# EAGLE board SBC_65C02_IRQ_BigBoard_v10-2-1 (EAGLE 9.6.2), part 1 of 2
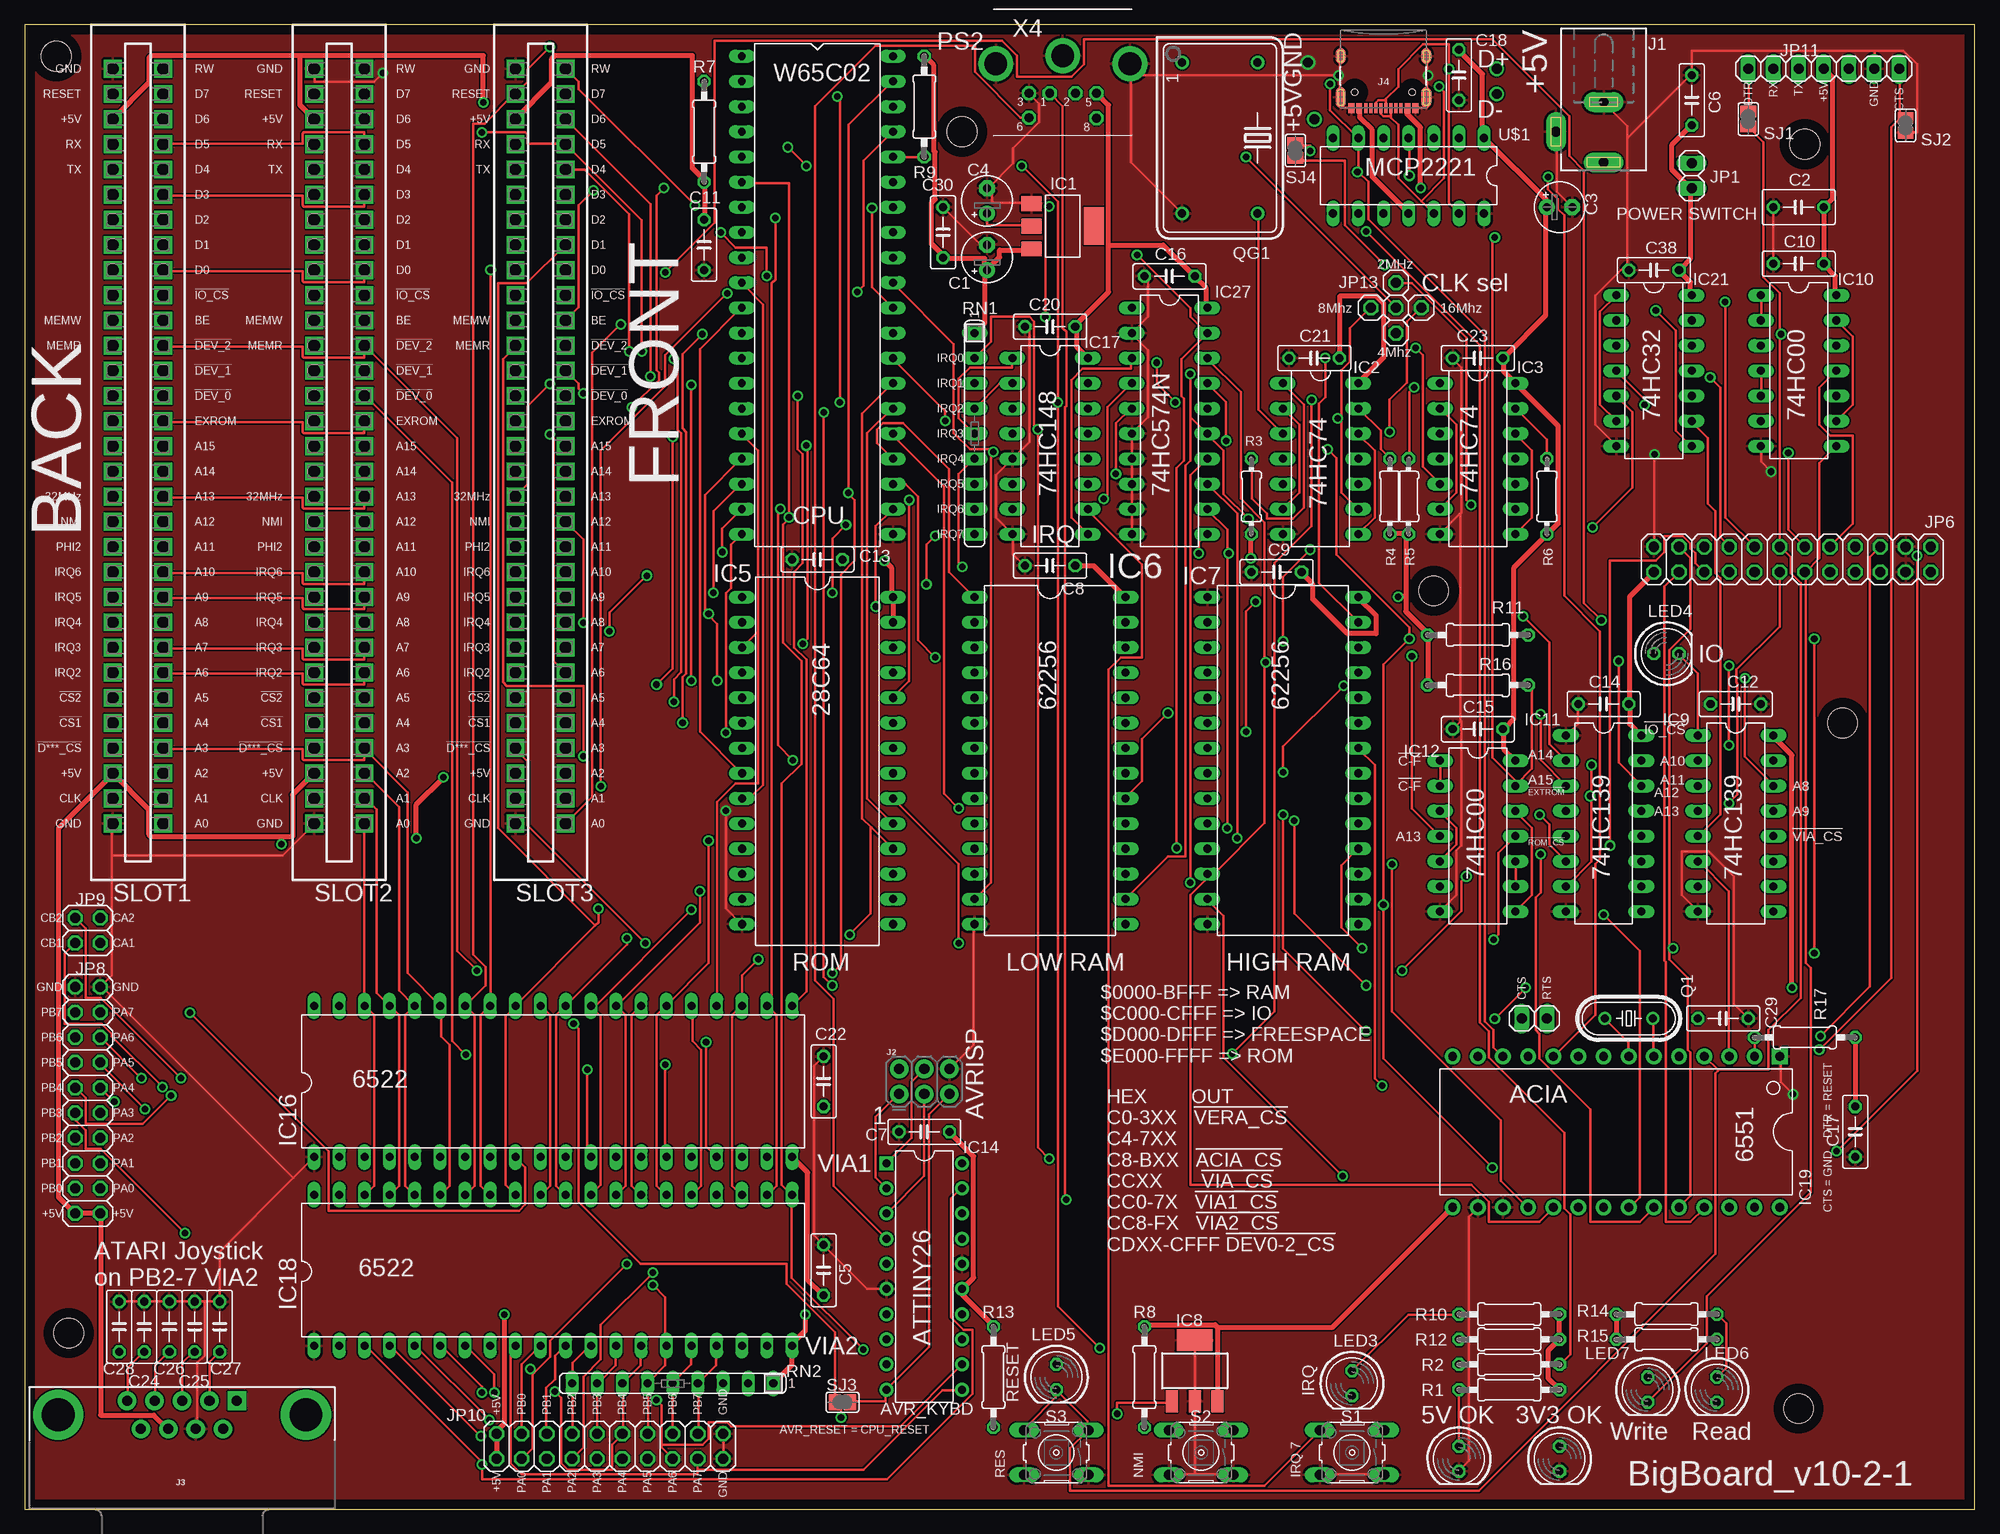
[diagram p8: board, top side]
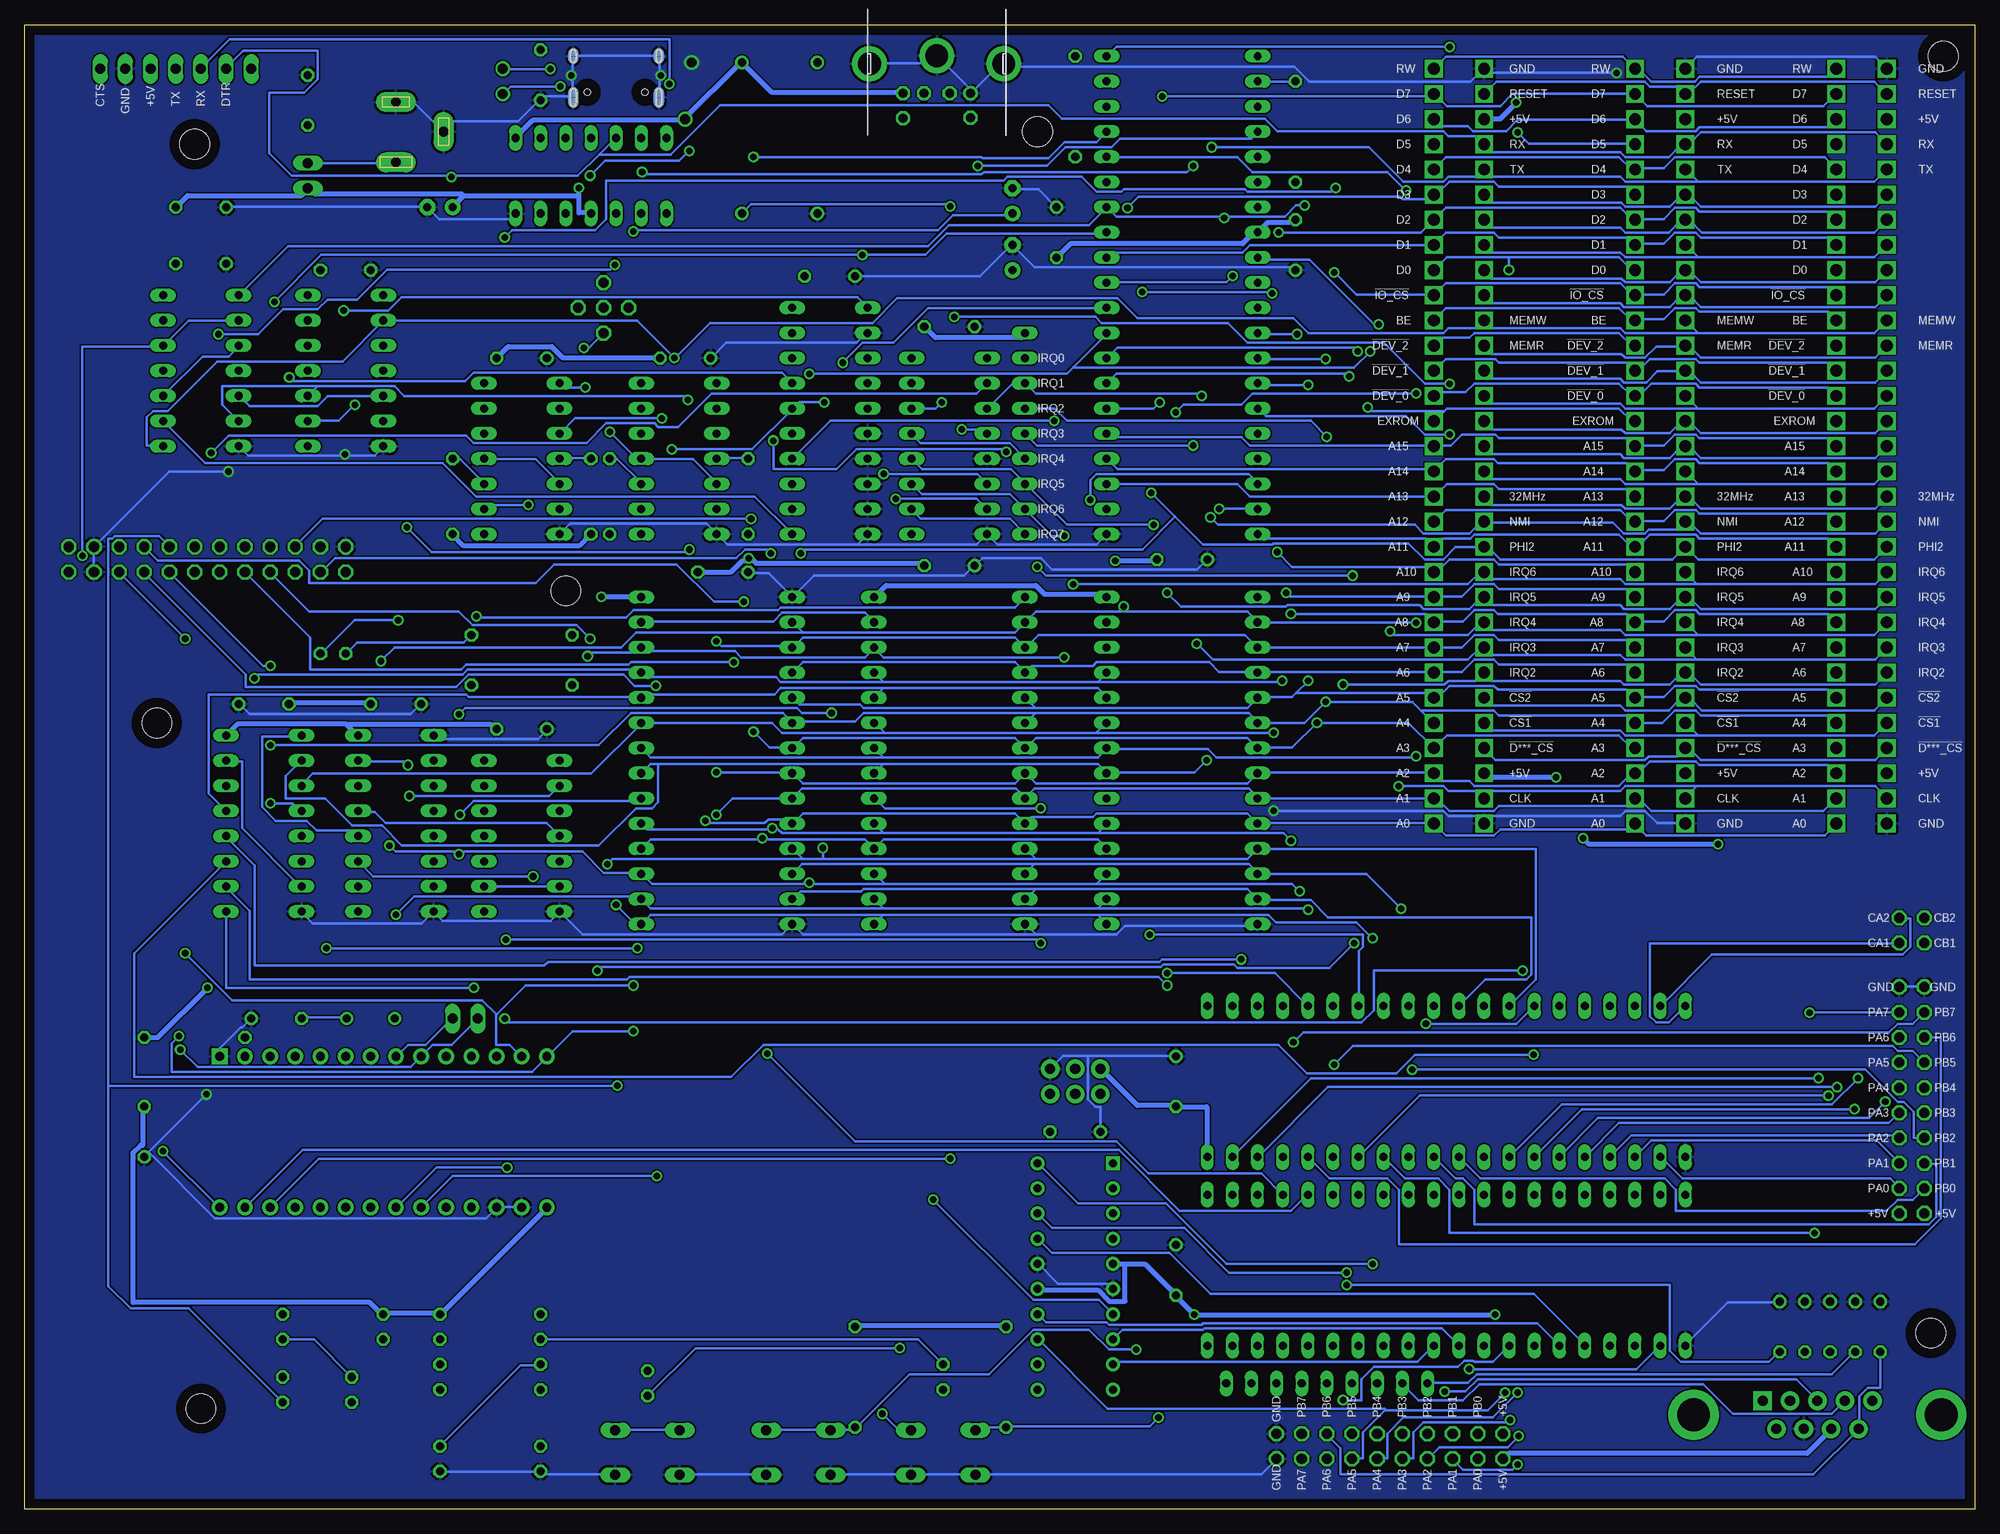
[diagram p9: board, bottom side, seen from below]

Size 196.85 x 149.86 mm. Coordinates in mm from the lower left corner, seen from the top.
Outline: 0,149.86 0,0 196.85,0 196.85,149.86 0,149.86
Copper layers (1*16): Top 0.035mm / dielectric 1.5mm / Bottom 0.035mm
Design rules "default *": minimum track width 6mil, minimum drill 0.35mm, track to track 6mil, track to pad 6mil, pad to pad 6mil, via to via 6mil, smd to smd 6mil, copper to edge 40mil, drill to drill 6mil, minimum pad ring 10mil, minimum via ring 8mil, stop-mask expansion 4mil, vias tented up to drill 0mil, thermal gap 10mil
Net classes: 0 default: width 0.254 mm, drill 0.66 mm, clearance 0.152 mm; 1 power: width 0.508 mm, drill 0.66 mm, clearance 0.178 mm to class 0, clearance 0.178 mm
Holes 3 mm at 3.17,146.69 183.51,79.38 179.7,137.79 179.07,10.16 142.24,92.71 4.45,17.78 94.62,139.06
vRestrict: area 160.7,0.6 to 192.4,7

## Footprints (pad centres in the part's own frame; a part is rotated, then mirrored left to right if it is on the bottom)
E2,5-5 = drill 0.813 pad 1.6: + -1.27,0 | drill 0.813 pad 1.6 octagon: - 1.27,0
C050-035X075 = drill 0.813 octagon: 1 -2.54,0; 2 2.54,0
C050-025X075 = drill 0.813 octagon: 1 -2.54,0; 2 2.54,0
SOT223 = smd 1.499 x 2.007: 1 -2.261,-3.15; 2 0.025,-3.15; 3 2.311,-3.15 | smd 3.81 x 2.007: 4 0,3.15
DIL14 = drill 0.813 long: 1 -7.62,-3.81; 2 -5.08,-3.81; 3 -2.54,-3.81; 4 0,-3.81; 5 2.54,-3.81; 6 5.08,-3.81; 7 7.62,-3.81; 8 7.62,3.81; 9 5.08,3.81; 10 2.54,3.81; 11 0,3.81; 12 -2.54,3.81; 13 -5.08,3.81; 14 -7.62,3.81
DIL40 = drill 0.8 long: 1 -7.62,20.32; 2 -7.62,17.78; 3 -7.62,15.24; 4 -7.62,12.7; 5 -7.62,10.16; 6 -7.62,7.62; 7 -7.62,5.08; 8 -7.62,2.54; 9 -7.62,0; 10 -7.62,-2.54; 11 -7.62,-5.08; 12 -7.62,-7.62; 13 -7.62,-10.16; 14 -7.62,-12.7; 15 -7.62,-15.24; 16 -7.62,-17.78; 17 -7.62,-20.32; 18 -7.62,-22.86; 19 -7.62,-25.4; 20 -7.62,-27.94; 21 7.62,-27.94; 22 7.62,-25.4; 23 7.62,-22.86; 24 7.62,-20.32; 25 7.62,-17.78; 26 7.62,-15.24; 27 7.62,-12.7; 28 7.62,-10.16; 29 7.62,-7.62; 30 7.62,-5.08; 31 7.62,-2.54; 32 7.62,0; 33 7.62,2.54; 34 7.62,5.08; 35 7.62,7.62; 36 7.62,10.16; 37 7.62,12.7; 38 7.62,15.24; 39 7.62,17.78; 40 7.62,20.32
DIL28-6 = drill 0.813 long: 1 -16.51,-7.62; 2 -13.97,-7.62; 3 -11.43,-7.62; 4 -8.89,-7.62; 5 -6.35,-7.62; 6 -3.81,-7.62; 7 -1.27,-7.62; 8 1.27,-7.62; 9 3.81,-7.62; 10 6.35,-7.62; 11 8.89,-7.62; 12 11.43,-7.62; 13 13.97,-7.62; 14 16.51,-7.62; 15 16.51,7.62; 16 13.97,7.62; 17 11.43,7.62; 18 8.89,7.62; 19 6.35,7.62; 20 3.81,7.62; 21 1.27,7.62; 22 -1.27,7.62; 23 -3.81,7.62; 24 -6.35,7.62; 25 -8.89,7.62; 26 -11.43,7.62; 27 -13.97,7.62; 28 -16.51,7.62
SOT223' = smd 1.219 x 2.235: 1 -2.311,-3.099; 2 0,-3.099; 3 2.311,-3.099 | smd 3.6 x 2.2: 4 0,3.099
DIL16 = drill 0.813 long: 1 -8.89,-3.81; 2 -6.35,-3.81; 3 -3.81,-3.81; 4 -1.27,-3.81; 5 1.27,-3.81; 6 3.81,-3.81; 7 6.35,-3.81; 8 8.89,-3.81; 9 8.89,3.81; 10 6.35,3.81; 11 3.81,3.81; 12 1.27,3.81; 13 -1.27,3.81; 14 -3.81,3.81; 15 -6.35,3.81; 16 -8.89,3.81
DIL20 = drill 0.8 pad 1.4 square: 1 -11.43,-3.81 | drill 0.8 pad 1.4: 2 -8.89,-3.81; 3 -6.35,-3.81; 4 -3.81,-3.81; 5 -1.27,-3.81; 6 1.27,-3.81; 7 3.81,-3.81; 8 6.35,-3.81; 9 8.89,-3.81; 10 11.43,-3.81; 11 11.43,3.81; 12 8.89,3.81; 13 6.35,3.81; 14 3.81,3.81; 15 1.27,3.81; 16 -1.27,3.81; 17 -3.81,3.81; 18 -6.35,3.81; 19 -8.89,3.81; 20 -11.43,3.81
DIL40' = drill 0.813 long: 1 -24.13,-7.62; 2 -21.59,-7.62; 3 -19.05,-7.62; 4 -16.51,-7.62; 5 -13.97,-7.62; 6 -11.43,-7.62; 7 -8.89,-7.62; 8 -6.35,-7.62; 9 -3.81,-7.62; 10 -1.27,-7.62; 11 1.27,-7.62; 12 3.81,-7.62; 13 6.35,-7.62; 14 8.89,-7.62; 15 11.43,-7.62; 16 13.97,-7.62; 17 16.51,-7.62; 18 19.05,-7.62; 19 21.59,-7.62; 20 24.13,-7.62; 21 24.13,7.62; 22 21.59,7.62; 23 19.05,7.62; 24 16.51,7.62; 25 13.97,7.62; 26 11.43,7.62; 27 8.89,7.62; 28 6.35,7.62; 29 3.81,7.62; 30 1.27,7.62; 31 -1.27,7.62; 32 -3.81,7.62; 33 -6.35,7.62; 34 -8.89,7.62; 35 -11.43,7.62; 36 -13.97,7.62; 37 -16.51,7.62; 38 -19.05,7.62; 39 -21.59,7.62; 40 -24.13,7.62
DIP-28 = drill 0.889 pad 1.6 square: 1 -15.24,-7.62 | drill 0.889 pad 1.6: 2 -12.7,-7.62; 3 -10.16,-7.62; 4 -7.62,-7.62; 5 -5.08,-7.62; 6 -2.54,-7.62; 7 0,-7.62; 8 2.54,-7.62; 9 5.08,-7.62; 10 7.62,-7.62; 11 10.16,-7.62; 12 12.7,-7.62; 13 15.24,-7.62; 14 17.78,-7.62; 15 17.78,7.62; 16 15.24,7.62; 17 12.7,7.62; 18 10.16,7.62; 19 7.62,7.62; 20 5.08,7.62; 21 2.54,7.62; 22 0,7.62; 23 -2.54,7.62; 24 -5.08,7.62; 25 -7.62,7.62; 26 -10.16,7.62; 27 -12.7,7.62; 28 -15.24,7.62
DIL20' = drill 0.813 long: 1 -11.43,-3.81; 2 -8.89,-3.81; 3 -6.35,-3.81; 4 -3.81,-3.81; 5 -1.27,-3.81; 6 1.27,-3.81; 7 3.81,-3.81; 8 6.35,-3.81; 9 8.89,-3.81; 10 11.43,-3.81; 11 11.43,3.81; 12 8.89,3.81; 13 6.35,3.81; 14 3.81,3.81; 15 1.27,3.81; 16 -1.27,3.81; 17 -3.81,3.81; 18 -6.35,3.81; 19 -8.89,3.81; 20 -11.43,3.81
DCJ0202 = drill 1 pad 2 long: 1 0,3.1; 2 4.8,0; 3 0,-3
2X3-NS = drill 1.016 pad 1.88: 1 -2.54,-1.27; 2 -2.54,1.27; 3 0,-1.27; 4 0,1.27; 5 2.54,-1.27; 6 2.54,1.27
DB9_MALE = drill 1.016 pad 1.88: 1 5.54,-1.42; 2 2.77,-1.42; 3 0,-1.42; 4 -2.77,-1.42; 6 4.15,1.42; 7 1.38,1.42; 8 -1.38,1.42; 9 -4.15,1.42 | drill 1.016 pad 1.88 square: 5 -5.54,-1.42 | drill 3.302 pad 5.08: G1 -12.5,0; G2 12.5,0
USB-C-16P = smd 0.3 x 1.016: A5 -1.25,0.154; A6 -0.25,0.154; A7 0.25,0.154; A8 1.25,0.154; B5 1.75,0.154; B6 0.75,0.154; B7 -0.75,0.154; B8 -1.75,0.154 | smd 0.6 x 1.016: GND -3.225,0.154; GND2 3.225,0.154 | smd 1 x 2.1: SHLD1 -4.32,-0.915; SHLD2 4.32,-0.915 | smd 1 x 2.1 bottom: SHLD3 -4.32,-0.915; SHLD4 4.32,-0.915 | smd 1 x 1.6: SHLD5 -4.32,-5.095; SHLD8 4.32,-5.095 | smd 1 x 1.6 bottom: SHLD6 -4.32,-5.095; SHLD7 4.32,-5.095 | smd 0.55 x 1.016: VBUS1 -2.45,0.154; VBUS2 2.45,0.154 | hole 0.65: -2.89,-1.445; 2.89,-1.445
1X02 = drill 1.016 long: 1 -1.27,0; 2 1.27,0
1X01 = drill 1.016 octagon: 1 0,0
2X12 = drill 1.016 octagon: 1 -13.97,-1.27; 2 -13.97,1.27; 3 -11.43,-1.27; 4 -11.43,1.27; 5 -8.89,-1.27; 6 -8.89,1.27; 7 -6.35,-1.27; 8 -6.35,1.27; 9 -3.81,-1.27; 10 -3.81,1.27; 11 -1.27,-1.27; 12 -1.27,1.27; 13 1.27,-1.27; 14 1.27,1.27; 15 3.81,-1.27; 16 3.81,1.27; 17 6.35,-1.27; 18 6.35,1.27; 19 8.89,-1.27; 20 8.89,1.27; 21 11.43,-1.27; 22 11.43,1.27; 23 13.97,-1.27; 24 13.97,1.27
2X10 = drill 1.016 octagon: 1 -11.43,-1.27; 2 -11.43,1.27; 3 -8.89,-1.27; 4 -8.89,1.27; 5 -6.35,-1.27; 6 -6.35,1.27; 7 -3.81,-1.27; 8 -3.81,1.27; 9 -1.27,-1.27; 10 -1.27,1.27; 11 1.27,-1.27; 12 1.27,1.27; 13 3.81,-1.27; 14 3.81,1.27; 15 6.35,-1.27; 16 6.35,1.27; 17 8.89,-1.27; 18 8.89,1.27; 19 11.43,-1.27; 20 11.43,1.27
2X02 = drill 1.016 octagon: 1 -1.27,-1.27; 2 -1.27,1.27; 3 1.27,-1.27; 4 1.27,1.27
1X07 = drill 1.016 long: 1 -7.62,0; 2 -5.08,0; 3 -2.54,0; 4 0,0; 5 2.54,0; 6 5.08,0; 7 7.62,0
LED5MM = drill 0.813 octagon: A -1.27,0; K 1.27,0
HC49/S = drill 0.813: 1 -2.413,0; 2 2.413,0
DIL14S = drill 0.813: 1 -7.62,-3.81; 7 7.62,-3.81; 8 7.62,3.81; 14 -7.62,3.81
0207/10 = drill 0.813 octagon: 1 -5.08,0; 2 5.08,0
0204/7 = drill 0.813 octagon: 1 -3.81,0; 2 3.81,0
SIL9 = drill 0.813 long: 1 -10.16,0; 2 -7.62,0; 3 -5.08,0; 4 -2.54,0; 5 0,0; 6 2.54,0; 7 5.08,0; 8 7.62,0; 9 10.16,0
B3F-10XX = drill 1.016 long: 1 -3.251,2.261; 2 3.251,2.261; 3 -3.251,-2.261; 4 3.251,-2.261
SJ = smd 1.168 x 1.6: 1 -0.762,0; 2 0.762,0
ISA-8 = drill 1.2 pad 1.778 square: A1 40.64,-2.54; A2 38.1,-2.54; A3 35.56,-2.54; A4 33.02,-2.54; A5 30.48,-2.54; A6 27.94,-2.54; A7 25.4,-2.54; A8 22.86,-2.54; A9 20.32,-2.54; A10 17.78,-2.54; A11 15.24,-2.54; A12 12.7,-2.54; A13 10.16,-2.54; A14 7.62,-2.54; A15 5.08,-2.54; A16 2.54,-2.54; A17 0,-2.54; A18 -2.54,-2.54; A19 -5.08,-2.54; A20 -7.62,-2.54; A21 -10.16,-2.54; A22 -12.7,-2.54; A23 -15.24,-2.54; A24 -17.78,-2.54; A25 -20.32,-2.54; A26 -22.86,-2.54; A27 -25.4,-2.54; A28 -27.94,-2.54; A29 -30.48,-2.54; A30 -33.02,-2.54; A31 -35.56,-2.54; B1 40.64,2.54; B2 38.1,2.54; B3 35.56,2.54; B4 33.02,2.54; B5 30.48,2.54; B6 27.94,2.54; B7 25.4,2.54; B8 22.86,2.54; B9 20.32,2.54; B10 17.78,2.54; B11 15.24,2.54; B12 12.7,2.54; B13 10.16,2.54; B14 7.62,2.54; B15 5.08,2.54; B16 2.54,2.54; B17 0,2.54; B18 -2.54,2.54; B19 -5.08,2.54; B20 -7.62,2.54; B21 -10.16,2.54; B22 -12.7,2.54; B23 -15.24,2.54; B24 -17.78,2.54; B25 -20.32,2.54; B26 -22.86,2.54; B27 -25.4,2.54; B28 -27.94,2.54; B29 -30.48,2.54; B30 -33.02,2.54; B31 -35.56,2.54
M_DIN6 = drill 0.9 pad 1.422 octagon: 1 -1.3,-3.75; 2 1.3,-3.75; 3 -3.4,-3.75; 5 3.4,-3.75; 6 -3.4,-6.2; 8 3.4,-6.25 | drill 2.3 pad 3.5: SH1 6.8,-0.75; SH2 0,0.05; SH3 -6.75,-0.75

## Placement (x,y rotation side)
C1  10uF  [E2,5-5]  97.16,126.37 90 top
C2  [C050-035X075]  179.07,131.44 180 top
C3  [E2,5-5]  154.94,131.44 0 top
C4  100uF  [E2,5-5]  97.16,132.08 90 top
C5  [C050-025X075]  80.64,24.13 90 top
C6  [C050-025X075]  168.28,142.24 90 top
C7  [C050-025X075]  90.81,38.1 180 top
C8  [C050-025X075]  103.5,95.25 180 top
C9  [C050-025X075]  126.37,94.61 0 top
C10  [C050-025X075]  179.07,125.73 180 top
C11  [C050-025X075]  68.58,127.63 270 top
C12  [C050-025X075]  172.72,81.28 0 top
C13  [C050-025X075]  80.01,95.89 180 top
C14  [C050-025X075]  159.38,81.28 180 top
C15  [C050-025X075]  146.69,78.74 180 top
C16  [C050-025X075]  115.57,124.46 180 top
C17  [C050-025X075]  184.78,38.1 90 top
C18  [C050-025X075]  144.78,144.78 270 top
C20  [C050-025X075]  103.5,119.38 180 top
C21  [C050-025X075]  130.18,116.21 180 top
C22  [C050-025X075]  80.64,43.18 90 top
C23  [C050-025X075]  146.69,116.21 180 top
C24  1n  [C050-025X075]  12.06,18.41 270 top
C25  1n  [C050-025X075]  17.14,18.41 90 top
C26  1n  [C050-025X075]  14.61,18.41 270 top
C27  1n  [C050-025X075]  19.69,18.41 90 top
C28  1n  [C050-025X075]  9.53,18.41 270 top
C29  [C050-025X075]  171.45,49.53 180 top
C30  [C050-025X075]  92.71,128.91 270 top
C38  [C050-025X075]  164.47,125.09 180 top
IC1  REG1117_3V3  [SOT223]  104.78,129.54 270 top
IC2  74HC74N  [DIL14]  130.81,106.05 270 top
IC3  74HC74N  [DIL14]  146.69,106.05 270 top
IC4  W65C02SP  [DIL40]  80.01,126.37 0 top
IC5  28C64AP  [DIL28-6]  80.01,75.56 270 top
IC6  62256  [DIL28-6]  103.5,75.56 270 top
IC7  62256  [DIL28-6]  127,75.56 270 top
IC8  DS1233  [SOT223']  118.11,13.97 0 top
IC9  74HCT139N  [DIL16]  172.72,69.22 270 top
IC10  74AC00N  [DIL14]  179.07,114.94 270 top
IC11  74HCT139N  [DIL16]  159.38,69.22 270 top
IC12  74AC00N  [DIL14]  146.69,67.94 270 top
IC14  ATTINY26-16PU  [DIL20]  90.81,23.49 270 top
IC16  VIA1  [DIL40']  53.34,43.18 0 top
IC17  74HC148N  [DIL16]  103.5,107.31 270 top
IC18  VIA2  [DIL40']  53.34,24.13 0 top
IC19  R6551  [DIP-28]  161.93,38.1 180 top
IC21  74AC32N  [DIL14]  164.47,114.94 270 top
IC27  74HC574N  [DIL20']  115.57,109.86 270 top
J1  DCJ0202  [DCJ0202]  159.38,139.06 180 top
J2  AVR_SPI_PROG_3X2NS  [2X3-NS]  90.81,43.18 0 top
J3  [DB9_MALE]  15.88,9.52 180 top
J4  [USB-C-16P]  137.16,141.6 180 top
JP1  [1X02]  168.28,134.62 270 top
JP2  [1X01]  140.97,121.28 0 top
JP3  [1X01]  135.89,121.28 0 top
JP4  [1X01]  138.43,118.75 0 top
JP5  [1X01]  138.43,123.82 0 top
JP6  [2X12]  178.44,95.89 0 top
JP8  Parallel  [2X10]  6.35,41.27 90 top
JP9  Timer_OUT  [2X02]  6.35,58.42 90 top
JP10  Parallel2  [2X10]  59.05,6.35 0 top
JP11  [1X07]  181.61,145.41 0 top
JP12  [1X02]  152.4,49.53 180 top
JP13  [1X01]  138.43,121.28 0 top
LED1  [LED5MM]  144.78,5.08 270 top
LED2  [LED5MM]  154.94,5.08 270 top
LED3  [LED5MM]  133.99,12.7 270 top
LED4  [LED5MM]  165.74,86.36 0 top
LED5  [LED5MM]  104.14,13.34 270 top
LED6  [LED5MM]  170.81,12.07 270 top
LED7  [LED5MM]  163.83,12.07 270 top
Q1  1,8432MHz  [HC49/S]  161.93,49.53 180 top
QG1  32Mhz  [DIL14S]  120.65,138.43 270 top
R1  680R  [0207/10]  149.86,12.07 0 top
R2  470R  [0207/10]  149.86,14.61 0 top
R3  4k7  [0204/7]  123.83,102.23 90 top
R4  4k7  [0204/7]  137.8,102.23 90 top
R5  4k7  [0204/7]  139.7,102.23 90 top
R6  4k7  [0204/7]  153.67,102.23 90 top
R7  22k  [0207/10]  68.58,139.06 90 top
R8  22k  [0207/10]  113.03,13.34 270 top
R9  22k  [0207/10]  90.81,141.6 270 top
R10  680R  [0207/10]  149.86,19.69 0 top
R11  680R  [0207/10]  146.69,88.27 180 top
R12  680R  [0207/10]  149.86,17.15 0 top
R13  22k  [0207/10]  97.79,13.34 270 top
R14  680R  [0207/10]  165.74,19.69 0 top
R15  680R  [0207/10]  165.74,17.15 0 top
R16  22K  [0207/10]  146.69,83.19 180 top
R17  22k  [0207/10]  179.7,47.62 0 top
RN1  22k  [SIL9]  95.89,108.58 270 top
RN2  22k  [SIL9]  65.41,12.7 180 top
S1  [B3F-10XX]  133.99,5.71 180 top
S2  [B3F-10XX]  118.75,5.71 180 top
S3  [B3F-10XX]  104.14,5.71 180 top
SJ1  [SJ]  173.99,140.34 90 top
SJ2  [SJ]  189.87,139.7 90 top
SJ3  [SJ]  82.55,10.8 0 top
SJ4  [SJ]  128.27,137.16 270 top
U$1  MCP2221A-I/P  [DIL14]  139.7,134.62 180 top
X1  [ISA-8]  11.43,104.78 90 top
X2  [ISA-8]  31.75,104.78 90 top
X3  [ISA-8]  52.07,104.78 90 top
X4  [M_DIN6]  104.78,146.69 0 top

## Tracks (layer width: path | path; a pad name or v marks a point on that pad's centre or on a via)
2MHZ  (via drill 0.66)
  Top 0.254: v146.03,101.38 145.53,101.88 145.53,118.25 140.03,123.75 138.53,123.75 JP5.1
  Bottom 0.254: v146.03,101.38 150.03,101.38 150.41,101 IC3.9
2PA0  (via drill 0.66)
  Top 0.254: JP10.3 50.28,5.12 51.28,6.12 51.28,13.88 v51.03,14.12 51.41,13.75 53.03,15.38 53.03,17 v60.78,24.75
  Bottom 0.254: v51.03,14.12 34.16,14.12 31.78,16.5 IC18.2 | v60.78,24.75 75.53,24.75 81.66,30.88 90.53,30.88 94.53,34.88 IC14.20
2PA1  (via drill 0.66)
  Top 0.254: IC18.3 34.41,16.5 46.16,4.75 v46.16,4.5 46.16,3 87.03,3 95.66,11.62 95.66,18.12 94.78,18.12 93.53,19.38 93.53,31.38 94.53,32.38 IC14.19
  Bottom 0.254: v46.16,4.5 46.66,4 51.66,4 52.66,5 JP10.5
2PA2  (via drill 0.66)
  Top 0.254: v46.03,7.38 36.91,16.5 IC18.4 | v63.41,23.88 58.16,18.62 58.16,15.12 56.41,13.38 56.41,6.25 55.28,5.12 JP10.7
  Bottom 0.254: v46.03,7.38 47.16,6.25 54.03,6.25 55.16,5.12 JP10.7 | v63.41,23.88 75.28,23.88 79.78,28.38 93.16,28.38 94.53,29.75 IC14.18
2PA3  (via drill 0.66)
  Top 0.254: v46.91,9 39.41,16.5 IC18.5
  Bottom 0.254: v46.91,9 47.16,8.75 55.66,8.75 56.66,7.75 56.66,5.12 57.78,5.12 JP10.9 | IC14.17 94.53,27.25 93.16,25.88 81.28,25.88 77.16,21.75 44.53,21.75 39.41,16.62 IC18.5
2PA4  (via drill 0.66)
  Top 0.254: v46.16,11.75 46.16,12.38 42.03,16.5 IC18.6
  Bottom 0.254: v46.16,11.75 48.66,9.25 57.66,9.25 59.28,7.62 59.28,5.12 60.28,5.12 JP10.11 | IC14.14 94.53,19.62 93.78,18.88 87.66,18.88 87.41,18.62 78.03,18.62 77.91,18.75 44.16,18.75 42.03,16.62 IC18.6
2PA5  (via drill 0.66)
  Top 0.254: v47.41,11.75 47.41,13.62 44.53,16.5 IC18.7
  Bottom 0.254: v47.41,11.75 49.16,10 59.53,10 | 59.53,10 61.78,7.75 61.78,5.12 62.78,5.12 JP10.13 | IC14.13 94.53,17.12 87.53,10.12 59.53,10.12 59.53,10
2PA6  (via drill 0.66)
  Top 0.254: v63.78,11 64.28,10.5 64.28,6.5 | 64.28,6.5 64.28,6.25 65.41,5.12 JP10.15 | 64.28,6.5 68.41,6.5 69.03,7.12 69.03,8.75 70.91,8.75 71.28,8.38 88.41,8.38 94.53,14.5 IC14.12
  Bottom 0.254: v63.78,11 61.91,11 61.91,13.12 60.66,14.38 52.16,14.38 51.53,15 50.66,15 50.53,14.88 48.66,14.88 47.03,16.5 IC18.8
2PA7
  Top 0.254: 67.91,4 67.91,5 JP10.17 | 67.91,4 67.91,3.5 50.16,3.5 49.03,4.62 49.03,16 49.53,16.5 IC18.9 | 67.91,4 84.66,4 92.66,12 94.53,12 IC14.11
2PB0
  Top 0.254: IC18.10 52.03,16.5 50.16,14.62 JP10.4
  Bottom 0.254: IC14.8 86.91,17.25 86.03,18.12 77.91,18.12 77.78,18.25 53.78,18.25 52.16,16.62 IC18.10
2PB1
  Top 0.254: IC18.11 54.53,16.5 53.53,15.5 53.53,13.12 52.66,12.25 52.66,7.62 JP10.6
  Bottom 0.254: IC14.9 86.91,14.62 86.66,14.88 56.28,14.88 54.66,16.5 IC18.11
2PB2
  Top 0.254: C24.2 12.03,15.88 10.41,14.25 10.41,11 J3.1 | JP10.8 55.28,7.62 55.28,12.62 RN2.9 55.28,12.75 55.28,14.75 57.03,16.5 IC18.12
  Bottom 0.254: C24.2 12.16,15.88 14.41,13.62 50.28,13.62 51.16,12.75 55.16,12.75 RN2.9
2PB3
  Top 0.254: C26.2 14.53,15.88 13.16,14.5 13.16,11 J3.2 | IC18.13 59.66,16.5 59.66,14.5 57.91,12.75 RN2.8 57.78,12.62 JP10.10
  Bottom 0.254: J3.2 13.16,10.88 14.41,9.62 24.41,9.62 27.41,12.62 50.03,12.62 51.66,11 56.16,11 57.78,12.62 RN2.8
2PB4  (via drill 0.66)
  Top 0.254: C25.1 17.03,15.88 15.91,14.75 15.91,11 J3.3 | IC18.14 62.16,16.5 62.16,14.5 60.41,12.75 RN2.7 60.41,12.62 60.41,7.62 JP10.12 60.28,7.5 59.28,6.5 59.28,4 54.78,4 54.16,4.62 54.16,11.25 v53.53,11.88
  Bottom 0.254: v53.53,11.88 51.41,11.88 50.16,13.12 18.03,13.12 15.91,11 J3.3
2PB5  (via drill 0.66)
  Top 0.254: C27.1 19.66,15.88 18.66,14.88 18.66,11 J3.4 | JP10.14 62.91,7.62 62.91,12.62 RN2.6 62.91,12.75 64.66,14.5 64.66,16.5 IC18.15 64.66,16.62 64.66,21.38 v63.41,22.62
  Bottom 0.254: v63.41,22.62 30.78,22.62 30.78,16 29.66,14.88 20.78,14.88 19.78,15.88 C27.1
2PB6
  Top 0.254: IC18.16 67.28,16.5 67.28,14.62 65.41,12.75 RN2.5 JP10.16
  Bottom 0.254: C28.2 9.53,12.25 10.78,12.25 11.66,11.38 11.66,8.12 J3.6 11.78,8 16.28,3.5 64.03,3.5 64.03,6.12 65.41,7.5 JP10.16
2PB7
  Top 0.254: IC18.17 69.78,16.5 69.78,14.5 68.03,12.75 RN2.4 68.03,12.62 68.03,7.62 JP10.18
4MHZ  (via drill 0.66)
  Top 0.254: v140.41,117.25 141.16,116.5 141.16,105.25 142.78,103.62 IC3.5
  Bottom 0.254: IC3.5 142.91,103.62 145.28,106 150.41,106 IC3.11 | v140.41,117.25 139.91,117.25 138.53,118.62 JP4.1
8MHZ  (via drill 0.66)
  Top 0.254: 132.91,110.12 132.91,115 133.78,115.88 133.78,119.25 135.78,121.25 JP3.1 | 132.91,110.12 132.91,102.62 134.53,101 IC2.9 | 132.91,110.12 v132.53,110.12
  Bottom 0.254: v132.53,110.12 141.28,110.12 142.78,108.62 IC3.3
16MHZ  (via drill 0.66)
  Top 0.254: v137.78,108.75 137.78,112 139.53,113.75 139.53,119.88 140.91,121.25 JP2.1
  Bottom 0.254: IC2.5 127.03,103.62 129.41,106 134.53,106 IC2.11 134.66,106.12 135.16,106.12 v137.78,108.75
32MHZ  (via drill 0.66)
  Top 0.254: IC2.3 126.91,108.62 124.53,111 124.53,130.75 QG1.8 | v103.41,131.5 103.03,131.12 v103.03,120.38 | v53.03,113.62 50.78,111.38 50.78,103.5 49.53,102.25 X3.B18
  Bottom 0.254: X1.B18 8.91,102.12 10.03,101 27.66,101 28.78,102.12 29.16,102.12 X2.B18 29.28,102.12 29.66,102.12 30.78,101 35.28,101 35.66,101.38 48.78,101.38 49.53,102.12 X3.B18 | v103.41,131.5 103.66,131.75 123.53,131.75 124.41,130.88 QG1.8 | v103.03,120.38 88.78,120.38 88.16,119.75 75.41,119.75 73.41,117.75 59.66,117.75 55.53,113.62 v53.03,113.62
!$C4-7  (via drill 0.66)
  Top 0.254: IC9.5 169.03,68 171.16,70.12 171.16,94 170.66,94.5 170.66,100.75 169.91,101.5 169.91,108.12 168.28,109.75 IC21.9 | v163.53,111.5 163.53,112 160.66,114.88 IC21.4
  Bottom 0.254: v163.53,111.5 165.16,109.88 168.16,109.88 IC21.9
!$DXXX_CS  (via drill 0.66)
  Top 0.254: v145.53,63.88 145.03,63.38 145.03,60.38 v139.03,54.38 | v62.66,57.12 50.78,69 50.78,75.5 49.53,76.75 X3.B28
  Bottom 0.254: X1.B28 8.91,76.75 10.03,75.62 27.66,75.62 28.78,76.75 29.16,76.75 X2.B28 29.28,76.75 30.03,76 32.91,76 33.28,75.62 48.41,75.62 49.53,76.75 X3.B28 | v145.53,63.88 161.66,63.88 163.16,65.38 IC11.11 | v139.03,54.38 138.66,54.75 82.16,54.75 81.91,55 74.78,55 74.41,54.62 65.16,54.62 v62.66,57.12
!A7  (via drill 0.66)
  Top 0.254: v121.91,46 126.16,50.25 126.16,95.5 129.91,99.25 v129.91,112
  Bottom 0.254: v121.91,46 113.03,37.12 86.66,37.12 83.41,33.88 72.03,33.88 69.91,31.75 IC18.24 | v129.91,112 130.28,112.38 158.53,112.38 159.53,113.38 167.28,113.38 | 167.28,113.38 168.16,112.5 IC21.10 | IC10.6 176.91,111.5 176.91,113.38 167.28,113.38
!AA_CS
  Top 0.254: IC21.6 160.66,109.88 159.03,111.5 159.03,120.88 160.66,122.5 IC21.1
!ACIA_CS
  Top 0.254: IC9.6 169.03,65.38 172.03,62.38 172.03,45.75 IC19.3
!C-F  (via drill 0.66)
  Top 0.254: IC12.2 142.91,73.12 142.91,75.5 IC12.1 | v158.16,75.12 158.16,72 | 158.16,72 158.16,65.38 155.66,62.88 IC11.7 | v158.03,72 158.16,72
  Bottom 0.254: v158.16,75.12 158.53,75.5 163.16,75.5 IC11.15 | v158.03,72 143.91,72 142.91,73 IC12.2
!DEV0_CS  (via drill 0.66)
  Top 0.254: v44.53,45.88 43.16,47.25 43.16,103.62 34.41,112.38 X2.A14
  Bottom 0.254: v44.53,45.88 56.53,45.88 58.41,44 67.41,44 70.28,46.88 122.28,46.88 125.53,43.62 185.78,43.62 185.78,56.12 176.53,65.38 IC9.11 | X1.A14 14.03,112.5 14.78,113.25 27.78,113.25 28.16,113.62 32.66,113.62 33.78,112.5 34.28,112.5 X2.A14 34.41,112.5 34.78,112.5 35.91,113.62 50.53,113.62 51.41,112.75 54.28,112.75 54.53,112.5 X3.A14
!DEV1_CS  (via drill 0.66)
  Top 0.254: v81.53,52.88 80.66,53.75 v80.66,110.75 | v56.41,112.62 55.91,113.12 55.91,113.62 54.66,114.88 X3.A13
  Bottom 0.254: X1.A13 14.03,115 14.78,115.75 27.78,115.75 28.16,116.12 32.78,116.12 33.91,115 34.28,115 X2.A13 34.41,115 35.16,115.75 48.03,115.75 48.41,116.12 53.41,116.12 54.53,115 X3.A13 | v81.53,52.88 82.41,53.75 135.78,53.75 136.03,53.5 174.16,53.5 174.16,60.38 176.53,62.75 IC9.10 | v80.66,110.75 79.91,111.5 74.03,111.5 72.91,112.62 v56.41,112.62
!DEV2_CS  (via drill 0.66)
  Top 0.254: v148.41,49.5 v151.53,52.62 | v45.66,54.38 43.66,56.38 43.66,108.12 34.41,117.38 X2.A12 34.28,117.38 34.28,116.25 28.16,116.25 28.03,116.38 28.03,117.38 14.03,117.38 X1.A12
  Bottom 0.254: IC9.9 176.53,52.62 v151.53,52.62 | v148.41,49.5 148.03,49.12 61.91,49.12 60.66,50.38 60.66,54.38 v45.66,54.38 | X3.A12 54.53,117.5 53.78,118.25 51.03,118.25 50.53,118.75 35.91,118.75 34.66,117.5 34.41,117.5 X2.A12
!E-F
  Top 0.254: IC12.10 150.53,65.38 150.53,62.88 IC12.9
  Bottom 0.254: IC12.6 142.91,62.88 150.41,62.88 IC12.9
!EXROM  (via drill 0.66)
  Top 0.254: R16.1 151.78,83.12 152.16,82.75 152.16,74.75 150.53,73.12 IC12.13 150.66,73.38 148.16,75.88 148.16,128.12 v148.41,128.38 | X1.A15 14.03,109.75 28.03,109.75 28.03,108.75 28.16,108.62 34.28,108.62 34.28,109.75 X2.A15 | v64.53,133.38 63.78,132.62 63.78,115 64.03,114.75 64.03,114 v61.28,111.25
  Bottom 0.254: 53.59,110.81 53.28,111.12 35.91,111.12 34.66,109.88 34.41,109.88 X2.A15 | 53.59,110.81 54.53,109.88 X3.A15 | v148.41,128.38 147.66,129.12 139.28,129.12 138.16,130.25 138.16,134.12 98.03,134.12 97.66,134.5 90.16,134.5 88.66,133 86.16,133 85.91,133.25 73.66,133.25 73.41,133 64.91,133 v64.53,133.38 | v61.28,111.25 60.91,110.88 53.66,110.88 53.59,110.81
!HRAM_CS  (via drill 0.66)
  Top 0.254: v152.91,70.12 153.91,69.12 153.91,67.12 155.53,65.5 IC11.6
  Bottom 0.254: v152.91,70.12 151.53,71.5 134.91,71.5 134.66,71.75 IC7.20
!IO_CS  (via drill 0.66)
  Top 0.254: LED4.K 167.03,86.25 168.91,84.38 168.91,78.12 IC9.1 | v159.16,89.75 157.41,91.5 157.41,135.12 155.91,136.62 155.91,140.62 148.16,148.38 106.91,148.38 106.91,145.88 105.66,144.62 100.16,144.62 100.16,146.75 98.66,148.25 69.66,148.25 69.66,129.88 v64.66,124.88
  Bottom 0.254: IC11.12 163.28,68 163.78,68.5 167.41,68.5 168.41,69.5 171.53,69.5 172.91,70.88 172.91,78 169.03,78 IC9.1 | X1.A10 14.03,122.62 14.78,123.38 27.78,123.38 28.16,123.75 30.28,123.75 31.41,122.62 34.28,122.62 X2.A10 34.41,122.62 34.66,122.62 35.78,123.75 53.41,123.75 54.53,122.62 X3.A10 54.66,122.62 62.41,122.62 v64.66,124.88 | v159.16,89.75 163.53,89.75 166.91,86.38 LED4.K
!IRQ_CS  (via drill 0.66)
  Top 0.254: v164.66,121 166.66,119 166.66,108.88 168.16,107.38 IC21.8
  Bottom 0.254: v164.66,121 160.16,121 158.78,122.38 112.78,122.38 111.78,121.38 IC27.1
!MEMR  (via drill 0.66)
  Top 0.254: IC10.11 182.78,114.88 181.16,113.25 181.16,109.5 182.28,108.38 184.53,108.38 184.53,99.5 182.28,97.25 JP6.16 | v56.41,76 56.41,83.12 48.66,83.12 48.28,83.5 48.28,116.12 49.53,117.38 X3.B12 | v137.03,42.75 136.28,43.5 136.28,75.12 134.66,76.75 IC7.22
  Bottom 0.254: 188.41,42.75 188.41,98 188.03,98 187.78,98.25 183.28,98.25 182.28,97.25 JP6.16 | 188.41,42.75 188.41,22.5 186.16,20.25 180.28,20.25 170.91,10.88 LED6.K | X1.B12 8.91,117.38 10.03,116.25 27.66,116.25 28.78,117.38 29.16,117.38 X2.B12 29.28,117.38 32.16,117.38 33.28,116.25 35.28,116.25 35.66,116.62 48.78,116.62 49.53,117.38 X3.B12 | 110.16,75.88 88.53,75.88 87.66,76.75 IC5.22 87.53,76.75 77.41,76.75 76.53,75.88 56.53,75.88 v56.41,76 | 110.16,75.88 111.03,76.75 IC6.22 | 110.16,75.88 133.66,75.88 134.53,76.75 IC7.22 | v137.03,42.75 188.41,42.75
!MEMW  (via drill 0.66)
  Top 0.254: LED7.K 163.91,10.88 169.78,16.75 169.78,21.5 180.28,32 180.28,54.62 179.78,55.12 179.78,94.5 JP6.13 179.78,94.62 181.16,96 181.16,105.62 182.78,107.25 IC10.8 | IC7.27 130.66,93.5 130.66,111.62 131.28,112.25 v131.28,116.25
  Bottom 0.254: X1.B11 10.16,118.75 27.91,118.75 | 27.91,118.75 29.16,120 X2.B11 | 27.91,118.75 35.28,118.75 35.78,119.25 48.78,119.25 49.53,120 X3.B11 49.66,120 50.41,119.25 53.16,119.25 53.66,118.75 67.28,118.75 68.78,120.25 84.53,120.25 86.53,122.25 108.78,122.25 111.28,119.75 127.66,119.75 131.16,116.25 v131.28,116.25 135.03,120 160.53,120 IC21.2 160.66,120 164.78,115.88 177.41,115.88 182.41,110.88 183.91,110.88 184.53,110.25 184.53,107.38 182.91,107.38 IC10.8 | IC6.27 111.16,89.62 112.03,90.5 120.41,90.5 121.28,89.62 134.53,89.62 IC7.27
!OTHER_CS
  Bottom 0.254: IC9.7 169.03,62.88 174.91,68.75 174.91,75.5 176.53,75.5 IC9.15
!RESET  (via drill 0.66)
  Top 0.254: 177.16,118.62 177.16,97.25 JP6.12 177.28,97.12 178.28,96.12 178.28,94.5 179.28,93.5 179.28,51.62 176.03,48.38 176.03,44.38 170.91,44.38 | 177.16,118.62 177.16,122.75 175.53,124.38 175.53,137.25 175.53,138 174.03,139.5 SJ1.1 | 170.91,44.38 169.66,45.62 IC19.4 | v53.03,147.62 50.78,145.38 50.78,144.12 X3.B2 49.41,142.88 46.41,139.88 45.28,139.88 45.28,56 46.53,54.75 46.53,52.88 44.53,50.88 IC16.34 44.53,50.75 45.41,49.88 45.41,32.62 44.53,31.75 IC18.34 | v110.28,9.62 110.28,10.75 115.78,10.75 IC8.1 | v82.41,9.25 82.41,10.25 81.91,10.75 SJ3.1 81.78,10.88 81.78,17.88 76.91,22.75 76.91,24.75 62.16,24.75 55.91,31 55.91,48.5 v55.41,49 | S3.4 100.91,8 100.91,8.12 104.41,11.62 LED5.K 104.16,12 107.28,8.88 107.28,8 S3.3 107.28,7.88 105.53,6.12 105.53,1.88 146.78,1.88 170.66,25.75 170.66,44 170.91,44.25 170.91,44.38 | v137.28,125.62 133.28,129.62 133.28,136.12 128.28,136.12 SJ4.2 | v177.28,118.62 177.16,118.62
  Bottom 0.254: X1.B2 8.91,142.88 10.16,144.12 27.66,144.12 28.91,142.88 X2.B2 29.28,142.88 30.03,143.62 32.78,143.62 33.28,144.12 48.28,144.12 X3.B2 | v53.03,147.62 86.66,147.62 87.53,146.75 IC4.40 | v110.28,9.62 108.66,8 107.41,8 S3.3 | v82.41,9.25 83.28,8.38 97.78,8.38 R13.2 97.91,8.25 100.53,8.25 100.78,8 S3.4 | v55.41,49 46.28,49 44.53,50.75 IC16.34 | v137.28,125.62 137.78,125.12 160.28,125.12 163.28,122.12 166.28,122.12 167.28,121.12 170.78,121.12 173.28,118.62 v177.28,118.62
!ROM_CS  (via drill 0.66)
  Top 0.254: v94.28,57.12 94.28,65.12 87.66,71.75 IC5.20 | v148.28,57.5 148.78,58 148.78,66.25 150.41,67.88 IC12.11
  Bottom 0.254: v94.28,57.12 94.66,57.5 v148.28,57.5
!USB_RESET  (via drill 0.66)
  Top 0.254: v129.78,137.12 129.78,137.62 128.28,137.62 SJ4.1 | v139.78,134.62 139.78,138.12 U$1.4
  Bottom 0.254: v129.78,137.12 130.78,136.12 138.28,136.12 v139.78,134.62
!VERA_CS  (via drill 0.66)
  Top 0.254: v172.03,71.25 172.91,72.12 172.91,83.38 172.78,83.5 172.78,84.75 177.16,89.12 177.16,94.5 JP6.11
  Bottom 0.254: v172.03,71.25 169.78,71.25 169.03,70.5 IC9.4
!VIA_CS  (via drill 0.66)
  Top 0.254: IC18.23 72.28,31.75 71.41,32.62 71.41,49.88 72.28,50.75 IC16.23 72.41,50.88 72.41,53.88 v74.03,55.5
  Bottom 0.254: v74.03,55.5 82.03,55.5 82.28,55.25 144.03,55.25 144.41,54.88 173.66,54.88 173.66,65 176.53,67.88 IC9.12
+3V3  (via drill 0.66)
  Top 0.254: C4.+ 97.16,129.62 101.53,129.62 IC1.2 | v135.41,129 146.91,117.5 146.91,49.12 147.78,48.25 147.78,45.62 155.41,38 155.41,30.38 156.03,29.75 156.03,15.62 155.03,14.62 R2.2
  Bottom 0.254: v135.41,129 135.28,129.12 104.66,129.12 103.16,130.62 97.28,130.62 97.16,130.75 C4.+
+5V  (via drill 0.66, 1 pad 1.3)
  Top 0.508: IC27.20 119.28,121.38 119.28,123.25 118.16,124.38 C16.1 117.91,124.62 114.91,127.62 109.41,127.62 | IC17.16 107.28,116.25 106.16,117.38 106.16,119.38 C20.1 106.16,119.62 109.41,122.88 109.41,127.62 | IC1.3 101.53,127.12 98.41,127.12 98.41,126.38 97.16,125.12 C1.+ | RN1.1 95.91,118.75 96.91,119.75 96.91,125 C1.+ | C1.+ 96.91,125.25 96.91,126.25 92.78,126.25 C30.2 92.66,126.62 91.53,127.75 91.53,131.88 91.91,132.25 91.91,137 91.78,137.12 91.78,145.75 90.91,146.62 R9.1 | 109.41,127.62 109.41,141.75 108.28,142.88 X4.5 | 27.78,146.75 12.78,146.75 12.53,146.5 12.53,144 8.91,140.38 X1.B3 | 27.78,146.75 27.78,141.75 29.16,140.38 X2.B3 | C11.1 68.66,130.25 68.66,133.88 R7.1 68.53,134.25 67.41,135.38 67.41,146.75 53.53,146.75 53.16,146.38 53.16,144 49.53,140.38 X3.B3 | 27.78,146.75 46.28,146.75 v46.28,142 | IC5.27 87.66,89.62 87.66,92 IC5.28 87.53,92.25 87.53,95 v86.78,95.75 | C8.1 107.91,95.25 111.03,92.12 IC6.28 | C9.2 128.91,94.5 130.03,93.38 130.03,91.88 133.53,88.38 136.41,88.38 136.41,90.25 134.66,92 IC7.28 | v123.78,96 123.78,98.38 R3.1 | IC12.14 150.41,75.62 149.28,76.75 149.28,78.62 C15.1 149.41,78.88 150.28,79.75 150.28,95 153.53,98.25 R6.1 153.78,98.5 154.78,99.5 154.78,109.38 150.66,113.5 IC3.14 150.41,113.75 149.28,114.88 149.28,116.12 C23.1 149.41,116.38 153.53,120.5 153.53,131.25 C3.+ 153.66,131.5 153.66,132.12 147.41,138.38 U$1.1 147.16,138.62 147.16,144.88 144.78,147.25 C18.1 | IC11.16 163.16,78.12 162.03,79.25 162.03,81.25 C14.1 162.03,81.5 162.03,92.12 164.41,94.5 JP6.1 | IC21.14 168.16,122.62 168.16,123.88 167.03,125 C38.1 167.16,125.25 168.16,126.25 168.16,133.12 JP1.2 168.16,133.38 166.28,135.25 166.28,137.75 168.16,139.62 C6.1
  Top 0.508: IC10.14 182.78,122.62 182.78,124.5 181.66,125.62 C10.1 181.66,125.88 181.66,131.38 C2.1 181.78,131.62 182.53,132.38 182.53,144.5 181.66,145.38 JP11.4 | R16.2 141.66,83.25 141.66,88.25 R11.2 141.53,88.5 139.41,90.62 139.41,92.12 | R4.1 137.91,98.5 139.66,98.5 R5.1 139.41,98.25 139.41,92.12 | IC2.14 134.66,113.75 137.16,116.25 137.16,121.75 136.41,122.5 132.78,122.5 132.78,116.25 C21.1 | J4.VBUS2 134.78,141.38 134.78,140.5 136.03,139.25 136.03,134.5 139.66,130.88 U$1.11 | v140.91,133.38 140.91,139.5 139.53,140.88 139.53,141.38 J4.VBUS1 | 139.41,92.12 v138.66,92.12 | 25.91,67.88 27.03,67.88 27.03,72.12 29.16,74.25 X2.B29 | 25.91,67.88 12.78,67.88 12.53,68.12 12.53,70.62 8.91,74.25 X1.B29 8.78,74.12 3.41,68.75 3.41,31.5 4.91,30 JP8.2 5.16,29.88 7.53,29.88 JP8.1 7.66,29.62 7.66,9.5 13.03,9.5 14.41,8.12 J3.7 | v42.28,73.88 39.53,71.12 v39.53,67.75 | 25.91,67.88 v25.91,67.12 | JP10.1 47.66,5.12 47.66,7.5 JP10.2 47.66,7.88 48.41,8.62 v48.41,19.62 | C17.2 184.78,40.75 R17.2 | R14.1 R15.1 | R1.2 154.91,12.12 153.78,13.25 153.78,16 154.91,17.12 R12.2 154.91,17.38 154.91,19.62 R10.2 | RN2.1 75.66,12.75 77.41,14.5 77.41,16.5 IC18.20 77.53,16.75 78.78,18 v78.78,19.62 | IC16.20 79.03,34 79.03,23.12 80.53,21.62 C5.1 | 120.41,18.38 120.41,10.88 IC8.3 | 120.41,18.38 120.16,18.62 113.03,18.62 R8.1 | C7.1 93.41,38 95.78,35.62 95.78,23.38 94.66,22.25 IC14.15 94.66,22 94.66,21.62 97.78,18.5 R13.1 | 120.41,18.38 132.03,18.38 144.03,30.38 IC19.15 | v178.41,52.62 178.41,76.12 176.53,78 IC9.16
  Bottom 0.508: X4.5 108.28,143 121.41,143 124.41,146 QG1.14 124.66,146 130.28,140.38 | C20.1 106.03,119.38 104.91,118.25 96.28,118.25 95.91,118.62 RN1.1 | C11.1 68.66,130.12 68.91,129.88 71.41,129.88 72.28,129 IC4.8 72.53,128.75 72.91,128.75 73.91,127.75 91.28,127.75 92.66,126.38 C30.2 | v46.28,142 47.91,140.38 49.53,140.38 X3.B3 | v86.78,95.75 82.78,95.75 82.66,95.88 C13.1 | C9.2 125.53,94.62 124.41,95.75 124.03,95.75 v123.78,96 123.53,96 123.03,95.5 106.41,95.5 106.16,95.25 C8.1 | IC5.28 87.66,92.12 87.91,92.38 93.91,92.38 94.78,93.25 109.91,93.25 111.03,92.12 IC6.28 | C12.1 170.16,81.38 162.03,81.38 C14.1 | 164.41,79.25 175.41,79.25 176.53,78.12 IC9.16 | 164.41,79.25 163.28,78.12 IC11.16 | 164.41,79.25 149.78,79.25 149.28,78.75 C15.1 | C2.1 181.53,131.5 180.41,132.62 168.91,132.62 168.28,133.25 JP1.2 168.03,133.25 167.53,132.75 152.66,132.75 152.53,132.62 | R6.1 153.66,98.38 152.53,97.25 140.91,97.25 139.78,98.38 R5.1 | C21.1 132.78,116.25 142.53,116.25 143.66,117.38 148.03,117.38 149.16,116.25 C23.1 | 140.91,132.62 140.91,130.88 139.78,130.88 U$1.11 | 140.91,132.62 v140.91,133.38 | 152.53,132.62 140.91,132.62 | 152.53,132.62 153.66,131.5 C3.+ | v138.66,92.12 134.66,92.12 IC7.28 | U$1.1 147.28,138.5 145.53,140.25 130.41,140.25 130.28,140.38 | v42.28,73.88 49.16,73.88 49.53,74.25 X3.B29 | v39.53,67.75 38.91,67.12 v25.91,67.12 | JP10.1 47.53,5.12 47.03,5.62 16.91,5.62 14.53,8 J3.7 | IC19.15 144.16,30.38 154.78,19.75 154.91,19.75 R10.2 155.16,19.75 160.66,19.75 R14.1 160.91,19.75 162.03,20.88 185.91,20.88 185.91,36 185.16,36.75 184.91,36.75 184.91,40.62 C17.2
  Bottom 0.508: IC16.20 77.53,35.62 77.53,40.62 80.53,40.62 C22.1 80.78,40.75 84.53,40.75 88.16,44.38 J2.2 | 85.78,24.75 86.91,24.75 IC14.5 | 85.78,24.75 83.78,24.75 80.66,21.62 C5.1 80.53,21.38 v78.78,19.62 v48.41,19.62 | R8.1 113.03,18.5 97.91,18.5 R13.1 | 85.78,24.75 85.78,21 87.41,21 88.53,22.12 94.53,22.12 IC14.15 | v178.41,52.62 183.41,47.62 R17.2 | 130.28,140.38 v130.18,140.34
A0  (via drill 0.66)
  Top 0.254: v180.66,56.12 v180.66,87.88 | IC18.38 34.41,31.75 35.28,32.62 35.28,49.88 34.41,50.75 IC16.38 34.28,50.88 34.28,69.12 X2.A31 | v60.16,119.62 57.28,116.75 57.28,71.88 54.66,69.25 X3.A31 | v135.41,52.88 128.16,60.12 v128.16,69.5
  Bottom 0.254: v180.66,87.88 187.28,94.5 JP6.19 | v180.66,56.12 175.91,51.38 150.66,51.38 149.28,50 | 149.28,50 149.28,46.88 147.91,46.88 146.78,45.75 IC19.13 | X1.A31 14.03,69.12 15.16,68 33.16,68 34.28,69.12 X2.A31 34.41,69.12 34.91,68.62 47.91,68.62 48.53,68 53.41,68 54.53,69.12 X3.A31 54.66,69.25 72.28,69.25 IC5.10 72.41,69.25 73.41,70.25 88.66,70.25 89.03,69.88 95.16,69.88 95.78,69.25 IC6.10 95.91,69.25 96.91,70.25 118.28,70.25 119.28,69.25 IC7.10 119.03,69.62 121.78,69.62 122.16,69.25 127.91,69.25 v128.16,69.5 | v60.16,119.62 60.66,119.62 67.16,126.12 72.16,126.12 72.28,126.25 IC4.9 | v135.41,52.88 146.28,52.88 149.16,50 149.28,50
A1  (via drill 0.66)
  Top 0.254: v181.28,47.75 186.28,52.75 186.28,96.12 187.28,97.12 JP6.20 | IC18.37 36.91,31.75 37.78,32.62 37.78,49.88 36.91,50.75 IC16.37 36.78,50.88 35.53,52.12 35.53,70.62 34.41,71.75 X2.A30 | IC4.10 72.41,123.75 74.53,121.62 74.53,73.12 73.28,71.88 72.41,71.88 IC5.9 | v135.41,48.25 127.03,56.62 v127.03,70.12
  Bottom 0.254: v181.28,47.75 182.03,47 182.03,44.12 145.66,44.12 144.16,45.62 IC19.14 144.03,45.75 141.53,48.25 v135.41,48.25 | X1.A30 14.03,71.75 15.28,70.5 32.66,70.5 33.91,71.75 X2.A30 34.41,71.75 35.16,71 48.03,71 48.53,70.5 53.03,70.5 54.28,71.75 54.53,71.75 X3.A30 54.66,71.75 72.28,71.75 IC5.9 72.41,71.88 73.28,72.75 94.91,72.75 95.78,71.88 IC6.9 95.91,71.88 96.78,72.75 118.41,72.75 119.28,71.88 IC7.9 119.41,71.75 125.41,71.75 v127.03,70.12
A2  (via drill 0.66)
  Top 0.254: v133.16,83.12 127.03,77 v127.03,74.38 | IC4.11 72.28,121.25 68.16,117.12 68.16,78.5 72.28,74.38 IC5.8 | IC18.36 39.28,31.75 38.41,32.62 38.41,49.88 39.28,50.75 IC16.36 39.28,50.88 37.78,52.38 37.78,70.88 34.41,74.25 X2.A29
  Bottom 0.254: v133.16,83.12 135.28,83.12 136.41,84.25 152.03,84.25 153.28,83 174.53,83 174.53,84.25 184.78,94.5 JP6.17 | v127.03,74.38 119.41,74.38 IC7.8 119.28,74.25 118.28,73.25 96.91,73.25 95.91,74.25 IC6.8 95.78,74.25 94.78,73.25 73.41,73.25 72.41,74.25 IC5.8 72.28,74.38 54.66,74.38 X3.A29 54.53,74.25 53.78,73.5 51.03,73.5 50.53,73 35.91,73 34.66,74.25 34.41,74.25 X2.A29 34.28,74.38 33.91,74.38 32.78,75.5 28.16,75.5 27.78,75.12 14.78,75.12 14.03,74.38 X1.A29
A3  (via drill 0.66)
  Top 0.254: v124.28,91.62 123.28,90.62 v123.28,78.5 | v68.41,118.62 66.41,116.62 66.41,109.12 66.78,108.75 66.78,84.38 66.41,84 v66.41,79.38 | IC18.35 42.03,31.75 42.91,32.62 42.91,46.88 42.03,47.75 42.03,50.75 IC16.35 41.91,50.88 38.66,54.12 38.66,72.38 34.41,76.62 X2.A28 34.28,76.75 34.28,75.62 28.16,75.62 28.03,75.75 28.03,76.75 14.03,76.75 X1.A28
  Bottom 0.254: v124.28,91.62 127.28,91.62 131.03,95.38 143.41,95.38 145.28,93.5 168.16,93.5 168.16,94.75 169.16,95.75 183.41,95.75 184.78,97.12 JP6.18 | v123.28,78.5 121.66,76.88 119.41,76.88 IC7.7 119.28,76.88 118.28,77.88 96.91,77.88 95.91,76.88 IC6.7 95.78,76.88 94.78,77.88 73.41,77.88 72.41,76.88 IC5.7 72.28,76.88 68.91,76.88 v66.41,79.38 57.16,79.38 54.66,76.88 X3.A28 54.53,76.88 53.28,78.12 35.91,78.12 34.66,76.88 34.41,76.88 X2.A28 | v68.41,118.62 72.28,118.62 IC4.12
A4  (via drill 0.66)
  Top 0.254: v65.53,116.12 65.91,115.75 65.91,109 66.28,108.62 66.28,84.5 65.53,83.75 v65.53,81.5 | v172.03,77.12 v172.03,85.12
  Bottom 0.254: X1.A27 14.03,79.38 14.78,80.12 27.66,80.12 28.16,80.62 30.28,80.62 31.53,79.38 X2.A27 34.41,79.38 35.16,80.12 48.03,80.12 48.53,80.62 55.78,80.62 55.84,80.56 | v65.53,116.12 72.28,116.12 IC4.13 | 94.84,80.31 94.78,80.38 73.28,80.38 72.41,79.5 IC5.6 67.66,79.38 v65.53,81.5 56.78,81.5 55.84,80.56 | 94.84,80.31 95.78,79.38 IC6.6 | 94.84,80.31 94.91,80.38 112.16,80.38 113.03,79.5 119.16,79.5 119.28,79.38 IC7.6 119.41,79.5 120.28,80.38 135.66,80.38 138.91,77.12 v172.03,77.12 | v172.03,85.12 172.78,85.12 182.16,94.5 JP6.15 | 55.84,80.56 54.66,79.38 X3.A27
A5  (via drill 0.66)
  Top 0.254: v67.28,83.62 v67.28,113.5
  Bottom 0.254: X1.A26 14.03,82 14.78,82.75 27.78,82.75 28.16,83.12 30.28,83.12 31.41,82 34.28,82 X2.A26 34.41,82 35.16,82.75 48.16,82.75 48.53,83.12 53.03,83.12 54.16,82 54.53,82 X3.A26 54.66,82 55.03,82.38 68.41,82.38 68.47,82.44 | v67.28,113.5 72.16,113.5 72.28,113.62 IC4.14 | 68.47,82.44 68.91,82 72.28,82 IC5.5 72.41,81.88 73.41,80.88 94.78,80.88 94.84,80.94 | 68.47,82.44 v67.28,83.62 | 94.84,80.94 95.78,81.88 IC6.5 | IC7.5 119.28,81.88 118.66,81.25 112.53,81.25 112.16,80.88 94.91,80.88 94.84,80.94
A6  (via drill 0.66)
  Top 0.254: X1.A25 14.03,84.38 28.03,84.38 28.03,83.38 28.16,83.25 34.28,83.25 34.28,84.38 X2.A25 | v53.03,108.5 53.41,108.12 53.41,85.62 54.53,84.5 X3.A25
  Bottom 0.254: IC7.4 119.28,84.5 118.28,85.5 96.91,85.5 95.91,84.5 IC6.4 95.78,84.5 95.16,85.12 89.03,85.12 88.66,85.5 77.28,85.5 76.28,84.5 72.41,84.5 IC5.4 72.28,84.5 54.66,84.5 X3.A25 54.53,84.5 51.78,84.5 50.53,85.75 48.53,85.75 48.03,85.25 35.16,85.25 34.41,84.5 X2.A25 | v53.03,108.5 55.53,108.5 57.41,110.38 71.53,110.38 72.28,111.12 IC4.15
A7  (via drill 0.66)
  Top 0.254: IC10.4 175.28,114.88 175.28,112.5 IC10.5 | v158.28,99.12 162.28,103.12 162.28,110.75 160.66,112.38 IC21.5 | v129.78,96.88 127.03,94.12 v127.03,87.62 | X1.A24 14.03,86.88 28.03,86.88 28.03,85.88 28.16,85.75 34.28,85.75 34.28,86.88 X2.A24 | 74.03,88.62 74.03,106.88 72.41,108.5 IC4.16 | 74.03,88.62 72.41,87 IC5.3 | 74.03,88.62 74.03,73.25 71.78,73.25 69.91,71.38 69.91,50.88 IC16.24
  Bottom 0.254: IC21.5 160.66,112.38 166.28,112.38 167.28,111.38 174.16,111.38 175.16,112.38 IC10.5 | v158.28,99.12 155.78,96.62 130.03,96.62 v129.78,96.88 | v127.03,87.62 126.53,87.12 119.28,87.12 IC7.3 119.28,87 118.28,88 96.91,88 95.91,87 IC6.3 95.78,87 94.53,88.25 73.66,88.25 72.41,87 IC5.3 72.28,87 54.66,87 X3.A24 54.53,87 51.78,87 50.53,88.25 48.53,88.25 48.03,87.75 35.16,87.75 34.41,87 X2.A24
A8  (via drill 0.66)
  Top 0.254: IC4.17 72.28,106 68.66,102.38 68.66,90.75 v69.03,90.38 69.03,90.25 69.91,89.38 v69.91,83.62 | v173.66,83.88 173.66,76 176.53,73.12 IC9.14
  Bottom 0.254: X1.A23 14.03,89.62 14.78,90.38 27.78,90.38 28.16,90.75 30.28,90.75 31.41,89.62 34.28,89.62 X2.A23 34.41,89.62 35.16,90.38 48.16,90.38 48.53,90.75 50.53,90.75 51.66,89.62 54.53,89.62 X3.A23 54.66,89.62 55.41,90.38 v69.03,90.38 | 88.47,83.56 88.53,83.5 110.16,83.5 | 88.47,83.56 87.66,84.38 IC5.25 | 110.16,83.5 111.03,84.38 IC6.25 | 110.16,83.5 120.53,83.5 121.03,84 134.16,84 134.53,84.38 IC7.25 134.66,84.5 134.91,84.75 152.16,84.75 152.66,84.25 173.28,84.25 v173.66,83.88 | v69.91,83.62 70.03,83.5 88.41,83.5 88.47,83.56
A9  (via drill 0.66)
  Top 0.254: X1.A22 14.03,92 28.03,92 28.03,91 28.16,90.88 34.28,90.88 34.28,92 X2.A22 | v69.53,92.5 69.53,100.75 72.28,103.5 IC4.18 | v89.28,101.88 89.28,83.62 87.66,82 IC5.24
  Bottom 0.254: v69.53,92.5 69.16,92.12 54.66,92.12 X3.A22 54.53,92.12 51.78,92.12 50.53,93.38 48.53,93.38 48.03,92.88 35.16,92.88 34.41,92.12 X2.A22 | 110.16,82.88 88.53,82.88 87.66,82 IC5.24 | 110.16,82.88 111.03,82 IC6.24 | 110.16,82.88 120.53,82.88 121.16,82.25 134.28,82.25 134.53,82 IC7.24 134.66,82 152.03,82 152.28,82.25 178.28,82.25 178.28,72.25 176.53,70.5 IC9.13 | v89.28,101.88 89.28,103.88 88.66,104.5 73.28,104.5 72.41,103.62 IC4.18
A10  (via drill 0.66)
  Top 0.254: X1.A21 14.03,94.5 28.03,94.5 28.03,93.5 28.16,93.38 34.28,93.38 34.28,94.5 X2.A21 | v70.41,96.62 70.41,99 72.28,100.88 IC4.19 | v76.28,101 76.03,100.75 76.03,77.12 v77.53,75.62
  Bottom 0.254: v70.41,96.62 68.91,95.12 55.16,95.12 54.66,94.62 X3.A21 54.53,94.62 54.28,94.62 53.03,95.88 48.53,95.88 48.03,95.38 35.16,95.38 34.41,94.62 X2.A21 | 110.16,75.25 88.53,75.25 87.66,74.38 IC5.21 87.53,74.38 78.78,74.38 v77.53,75.62 | 110.16,75.25 111.03,74.38 IC6.21 | 110.16,75.25 132.91,75.25 | 132.91,75.25 133.66,75.25 134.53,74.38 IC7.21 | 132.91,75.25 132.91,71.38 133.53,70.75 135.16,70.75 138.91,67 158.78,67 160.78,69 163.78,69 166.53,71.75 170.53,71.75 170.53,74 169.03,75.5 IC9.2 | v76.28,101 72.41,101 IC4.19
A11  (via drill 0.66)
  Top 0.254: v70.78,78.38 70.78,92.5 71.28,93 71.28,97.38 72.28,98.38 IC4.20
  Bottom 0.254: IC4.20 72.28,98.38 71.91,98 55.41,98 54.66,97.25 X3.A20 54.53,97.25 53.78,98 50.91,98 50.53,98.38 35.91,98.38 34.78,97.25 34.41,97.25 X2.A20 34.28,97.25 33.91,97.25 32.78,98.38 28.16,98.38 27.78,98 14.78,98 14.03,97.25 X1.A20 | 88.59,78.44 88.66,78.38 110.03,78.38 | 88.59,78.44 87.66,79.38 IC5.23 | 110.03,78.38 111.03,79.38 IC6.23 | 110.03,78.38 120.41,78.38 121.41,79.38 IC7.23 134.66,79.25 139.66,74.25 167.78,74.25 168.91,73.12 IC9.3 | v70.78,78.38 88.53,78.38 88.59,78.44
A12  (via drill 0.66)
  Top 0.254: v85.91,91.12 85.91,99.25 87.53,100.88 IC4.22 | v160.91,85.62 160.91,75.38 163.16,73.12 IC11.14 | v56.41,89.5 56.41,97.88 54.66,99.62 X3.A19
  Bottom 0.254: X1.A19 14.03,99.75 14.78,100.5 27.78,100.5 28.16,100.88 30.28,100.88 31.41,99.75 34.28,99.75 X2.A19 34.41,99.75 34.66,99.75 35.78,100.88 53.41,100.88 54.53,99.75 X3.A19 | 86.34,90.69 86.41,90.62 94.78,90.62 95.78,89.62 IC6.2 95.91,89.5 96.91,88.5 118.28,88.5 118.34,88.56 | 86.34,90.69 v85.91,91.12 | 86.34,90.69 86.28,90.62 73.41,90.62 72.41,89.62 IC5.2 72.28,89.5 v56.41,89.5 | 118.34,88.56 119.28,89.5 IC7.2 | v160.91,85.62 159.53,87 136.66,87 135.16,88.5 118.41,88.5 118.34,88.56
A13  (via drill 0.66)
  Top 0.254: v140.03,86.12 140.03,70.75 142.78,68 IC12.4 | X1.A18 14.03,102.12 28.03,102.12 28.03,101.12 28.16,101 34.28,101 34.28,102.12 X2.A18 | v91.91,86 90.16,87.75 90.16,102.25 88.91,103.5 87.66,103.5 IC4.23
  Bottom 0.254: IC12.4 142.91,68 144.16,69.25 160.41,69.25 161.53,70.38 163.16,70.38 IC11.13 | v140.03,86.12 139.66,86.5 134.28,86.5 IC7.26 134.53,86.88 134.28,86.62 125.16,86.62 124.53,86 112.03,86 111.16,86.88 IC6.26 111.03,86.88 110.16,86 v91.91,86 | IC4.23 87.53,103.5 74.41,103.5 73.16,102.25 54.66,102.25 X3.A18 54.53,102.25 53.28,103.5 48.53,103.5 48.03,103 35.16,103 34.41,102.25 X2.A18
A14  (via drill 0.66)
  Top 0.254: v151.28,90.12 153.91,87.5 153.91,77.25 155.53,75.62 IC11.2 | IC6.1 95.78,92.12 93.28,94.62 93.28,105 88.66,109.62 86.66,109.62 86.03,109 86.03,107.62 87.53,106.12 IC4.24
  Bottom 0.254: v151.28,90.12 151.16,90 136.16,90 135.41,90.75 120.78,90.75 120.53,91 96.91,91 95.91,92 IC6.1 | X1.A17 14.03,104.88 14.78,105.62 27.78,105.62 28.16,106 30.28,106 31.41,104.88 34.28,104.88 X2.A17 34.41,104.88 35.16,105.62 48.16,105.62 48.53,106 53.41,106 54.53,104.88 X3.A17 54.66,104.88 54.78,105 86.53,105 87.53,106 IC4.24
A15  (via drill 0.66)
  Top 0.254: v94.28,70.75 92.78,72.25 92.78,103.25 87.66,108.38 87.66,108.5 IC4.25 | v153.03,80.25 153.03,75.62 155.53,73.12 IC11.3 | v115.41,80.38 112.78,77.75 112.78,73.5 111.16,71.88 IC6.20
  Bottom 0.254: X1.A16 14.78,108.12 27.78,108.12 28.16,108.5 30.28,108.5 31.41,107.38 34.28,107.38 X2.A16 34.41,107.38 35.16,108.12 48.03,108.12 48.41,108.5 51.78,108.5 52.91,107.38 54.53,107.38 X3.A16 54.66,107.38 73.16,107.38 74.03,108.25 87.28,108.25 87.53,108.5 IC4.25 | v94.28,70.75 110.03,70.75 111.03,71.75 IC6.20 | v153.03,80.25 152.41,80.88 118.91,80.88 118.41,80.38 v115.41,80.38
ACIA_CSH
  Top 0.254: R17.1 174.66,47.62 174.66,45.75 IC19.2
AVR_RST
  Top 0.254: SJ3.2 83.41,10.88 86.91,10.88 86.91,12 IC14.10 87.03,12.12 91.28,16.38 91.28,39.88 93.28,41.88 J2.5
BE  (via drill 0.66)
  Top 0.254: IC4.36 87.66,136.5 90.78,136.5 R9.2 | v57.41,133.12 55.91,131.62 55.91,121.38 54.66,120.12 X3.A11
  Bottom 0.254: X1.A11 14.03,120.12 14.78,120.88 27.78,120.88 28.16,121.25 30.28,121.25 31.41,120.12 34.28,120.12 X2.A11 34.41,120.12 34.78,120.12 35.91,121.25 53.41,121.25 54.53,120.12 X3.A11 | v57.41,133.12 59.28,135 72.91,135 74.41,136.5 87.53,136.5 IC4.36
C-F
  Top 0.254: IC12.5 142.91,65.5 144.53,67.12 144.53,68.75 142.91,70.38 IC12.3
CA1
  Bottom 0.254: IC16.40 29.28,50.75 30.91,49.12 32.16,49.12 32.78,49.75 32.78,57.12 7.66,57.12 JP9.1
CA2
  Bottom 0.254: IC16.39 31.66,50.88 26.53,56 7.28,56 6.53,56.75 6.53,59.62 7.53,59.62 JP9.3
CB1  (via drill 0.66)
  Top 0.254: v13.91,42.62 8.78,47.75 8.78,48 7.78,49 4.03,49 4.03,56.12 5.03,57.12 JP9.2
  Bottom 0.254: v13.91,42.62 65.28,42.62 72.28,35.62 IC16.18
CB2  (via drill 0.66)
  Top 0.254: v15.78,43.5 7.66,51.62 6.16,51.62 6.16,58.62 5.16,59.62 JP9.4
  Bottom 0.254: v15.78,43.5 67.03,43.5 74.91,35.62 IC16.19
CLK  (via drill 0.66)
  Top 0.254: v123.28,136.5 138.41,121.38 JP13.1 | v58.16,73 58.16,106.88 64.66,113.38 64.66,116.5 v70.91,122.75 | v84.03,122.88 84.66,123.5 84.66,136.12 87.53,139 IC4.37
  Bottom 0.254: 28.03,73 10.03,73 8.91,71.88 X1.B30 | 28.03,73 29.16,71.88 X2.B30 | 28.03,73 35.28,73 35.78,72.5 48.91,72.5 49.53,71.88 X3.B30 49.66,71.88 50.28,72.5 53.16,72.5 53.66,73 v58.16,73 | v123.28,136.5 100.28,136.5 100.16,136.38 93.53,136.38 91.91,138 88.66,138 87.66,139 IC4.37 | v70.91,122.75 71.03,122.88 v84.03,122.88
CS_1
  Bottom 0.254: 27.91,78.12 10.16,78.12 8.91,79.38 X1.B27 | 27.91,78.12 29.16,79.38 X2.B27 | X3.B27 48.78,78.62 35.78,78.62 35.28,78.12 27.91,78.12
CS_2
  Bottom 0.254: X1.B26 8.91,81.88 10.16,80.62 27.53,80.62 28.78,81.88 29.16,81.88 X2.B26 29.28,81.88 29.66,81.88 30.91,80.62 35.28,80.62 35.78,81.12 48.78,81.12 49.53,81.88 X3.B26
CTS  (via drill 0.66)
  Top 0.254: JP11.7 189.28,145.38 189.28,141 189.78,140.5 SJ2.2 189.53,140.62 188.41,139.5 188.41,53.62 v181.16,46.38
  Bottom 0.254: JP12.2 151.16,49.5 153.78,46.88 155.66,46.88 156.78,45.75 IC19.9 156.91,45.62 157.91,44.62 179.41,44.62 v181.16,46.38
D0  (via drill 0.66)
  Top 0.254: v112.28,126.62 117.66,121.25 117.66,120.38 119.28,118.75 IC27.19 119.28,118.62 116.78,116.12 116.78,112.38 117.03,112.12 117.03,105.88 116.28,105.12 v116.28,66.75 | JP6.10 171.66,100.12 v171.66,121.88 | X1.A9 14.03,125 28.03,125 28.03,124 28.16,123.88 34.28,123.88 34.28,125 X2.A9 | IC18.33 46.91,31.75 46.03,32.62 46.03,49.88 46.91,50.75 IC16.33 47.03,50.88 v47.03,125.12 | v138.03,65.12 138.03,50.25 149.03,39.25 149.03,33.12 151.66,30.5 IC19.18
  Bottom 0.254: IC4.33 87.66,128.88 87.78,128.75 103.78,128.75 105.91,126.62 v112.28,126.62 166.91,126.62 v171.66,121.88 | 47.03,126.38 35.91,126.38 34.66,125.12 34.41,125.12 X2.A9 | 47.03,126.38 53.28,126.38 54.53,125.12 X3.A9 | 94.78,65.62 73.41,65.62 72.41,66.62 IC5.11 72.28,66.62 44.28,66.62 44.28,53.5 46.91,50.88 IC16.33 | 94.78,65.62 95.78,66.62 IC6.11 | 118.34,65.69 118.28,65.62 116.28,65.62 | 118.34,65.69 119.28,66.62 IC7.11 | 94.78,65.62 116.28,65.62 | v138.03,65.12 137.53,65.62 118.41,65.62 118.34,65.69 | v47.03,125.12 47.03,126.38 | 116.28,65.62 v116.28,66.75
D1  (via drill 0.66)
  Top 0.254: IC18.32 48.53,32.75 48.53,49.75 49.53,50.75 IC16.32 49.53,50.88 57.59,58.94 | 125.16,85.5 125.16,69.25 120.16,64.25 119.41,64.25 IC7.12 119.28,64.12 119.28,63.62 117.66,62 117.66,32.75 146.03,32.75 147.78,31 147.78,29 152.91,29 154.28,30.38 IC19.19 | 125.16,85.5 125.16,99.62 122.78,102 122.78,112.75 119.41,116.12 IC27.18 | v125.28,85.5 125.16,85.5 | 57.59,58.94 57.91,59.25 v57.91,60.62 | 57.59,58.94 47.78,68.75 47.78,123.75 50.66,123.75 54.53,127.62 X3.A8
  Bottom 0.254: X1.A8 14.03,127.75 14.66,128.38 27.66,128.38 28.16,128.88 30.28,128.88 31.41,127.75 34.28,127.75 X2.A8 35.03,128.38 48.03,128.38 48.53,128.88 53.41,128.88 54.53,127.75 X3.A8 54.66,127.62 73.16,127.62 73.91,126.88 87.03,126.88 87.53,126.38 IC4.32 | 94.91,65.12 73.28,65.12 72.41,64.25 IC5.12 72.28,64.12 61.41,64.12 v57.91,60.62 | 94.91,65.12 95.78,64.25 IC6.12 | 94.91,65.12 118.41,65.12 119.28,64.25 IC7.12 | v125.28,85.5 135.66,85.5 135.91,85.25 152.28,85.25 152.78,84.75 168.03,84.75 168.03,88 174.53,94.5 JP6.9
D2  (via drill 0.66)
  Top 0.254: IC18.31 52.16,31.75 53.03,32.62 53.03,49.88 52.16,50.75 IC16.31 | 97.53,106.75 97.53,63.25 95.91,61.62 IC6.13 | 97.53,106.75 97.53,107 95.41,107 93.78,108.62 93.78,117.62 87.66,123.75 IC4.31 | v121.28,107.88 121.28,111.75 119.41,113.62 IC27.17 | v97.78,106.75 97.53,106.75 | v170.16,114.25 171.16,113.25 171.16,98.12 172.03,97.25 JP6.8 | v133.03,33.62 121.03,45.62 121.03,59.88 119.41,61.5 IC7.13 | v70.28,128.88 71.78,127.38 74.91,127.38 v74.91,124.5
  Bottom 0.254: X1.A7 14.03,130.25 14.78,131 27.78,131 28.16,131.38 30.28,131.38 31.41,130.25 34.28,130.25 X2.A7 34.41,130.25 34.66,130.25 35.78,131.38 53.41,131.38 54.53,130.25 X3.A7 54.66,130.12 55.91,128.88 v70.28,128.88 | 94.78,62.62 73.41,62.62 72.41,61.62 IC5.13 72.28,61.5 67.03,61.5 65.28,59.75 44.78,59.75 44.78,54 45.28,53.5 49.41,53.5 52.03,50.88 IC16.31 | 94.78,62.62 95.78,61.62 IC6.13 | 94.78,62.62 112.16,62.62 112.41,62.38 118.53,62.38 119.28,61.62 IC7.13 | v121.28,107.88 121.28,105 114.91,105 112.91,107 98.03,107 v97.78,106.75 | v170.16,114.25 169.78,113.88 152.41,113.88 151.53,114.75 120.41,114.75 119.41,113.75 IC27.17 | v133.03,33.62 153.66,33.62 156.78,30.5 IC19.20 | v74.91,124.5 75.53,123.88 87.53,123.88 IC4.31
D3  (via drill 0.66)
  Top 0.254: X1.A6 14.03,132.62 28.03,132.62 28.03,131.62 28.16,131.5 34.28,131.5 34.28,132.62 X2.A6 | v85.53,131.38 85.53,123.38 87.53,121.38 IC4.30 | v116.16,111.75 114.28,113.62 v114.28,115.75 | IC18.30 54.53,31.75 53.66,32.62 53.66,49.88 54.53,50.75 IC16.30 54.66,50.88 60.78,57 v60.78,57.62 | v148.16,34.5 137.16,45.5 v137.16,61 137.16,85.25 v139.78,87.88 139.78,89 132.41,96.38 132.41,106.12 v131.53,107